# Altium project LED_Board.PrjPcb
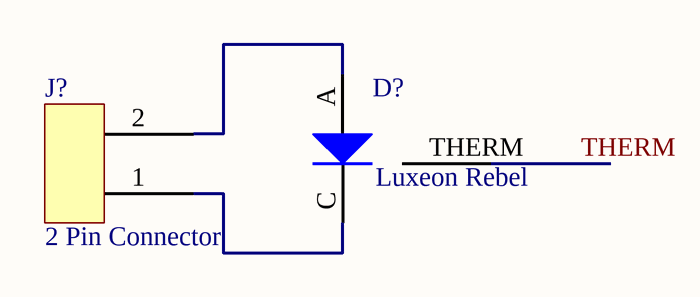
[diagram p0: LED_Board.SchDoc]
1 sheet, 2 parts. Net scope: global (net labels, ports and power ports of the same name join across sheets).
Board file: LED_Board.PcbDoc

## Sheet LED_Board.SchDoc
size A

### Parts
D?  Luxeon Rebel  [Luxeon Rebel]
J?  2 Pin Connector  [2pin smd pad for LED connector]

### Nets
THERM: D?.THERM
NetD?_A: D?.A J?.2
NetD?_C: D?.C J?.1